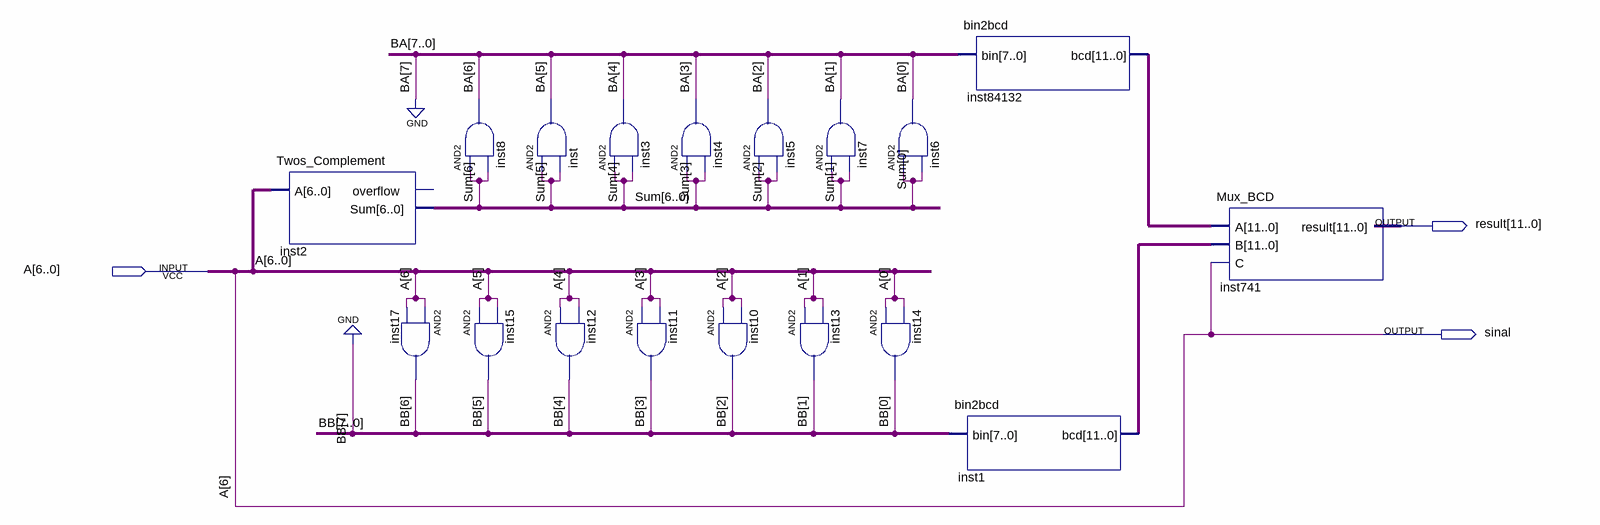
[diagram p0: schematic sheet]
// Quartus schematic BCD_Conversor.bdf as structural Verilog: 18 symbols, 3 pins
module BCD_Conversor (
  input  [6:0] A,
  output [11:0] result,
  output sinal
);

  wire [6:0] BA, BB, Sum;
  wire [11:0] inst1_bcd, inst84132_bcd;

  Twos_Complement inst2 (.A(A), .Sum(Sum));  // open: overflow
  and inst17 (BB[6], A[6], A[6]);
  and inst8 (BA[6], Sum[6], Sum[6]);
  and inst15 (BB[5], A[5], A[5]);
  and inst (BA[5], Sum[5], Sum[5]);
  and inst12 (BB[4], A[4], A[4]);
  and inst3 (BA[4], Sum[4], Sum[4]);
  and inst11 (BB[3], A[3], A[3]);
  and inst4 (BA[3], Sum[3], Sum[3]);
  and inst10 (BB[2], A[2], A[2]);
  and inst5 (BA[2], Sum[2], Sum[2]);
  and inst7 (BA[1], Sum[1], Sum[1]);
  and inst13 (BB[1], A[1], A[1]);
  and inst6 (BA[0], Sum[0], Sum[0]);
  and inst14 (BB[0], A[0], A[0]);
  bin2bcd inst84132 (.bin({1'b0, BA}), .bcd(inst84132_bcd));
  bin2bcd inst1 (.bin({1'b0, BB}), .bcd(inst1_bcd));
  Mux_BCD inst741 (.A(inst84132_bcd), .B(inst1_bcd), .C(A[6]), .result(result));

  assign sinal = A[6];
endmodule
